# Altium schematic sheet IMX8_DISPLAY.SchDoc
size 594 x 420 mm; SheetNumber: 10; SheetTotal: 20
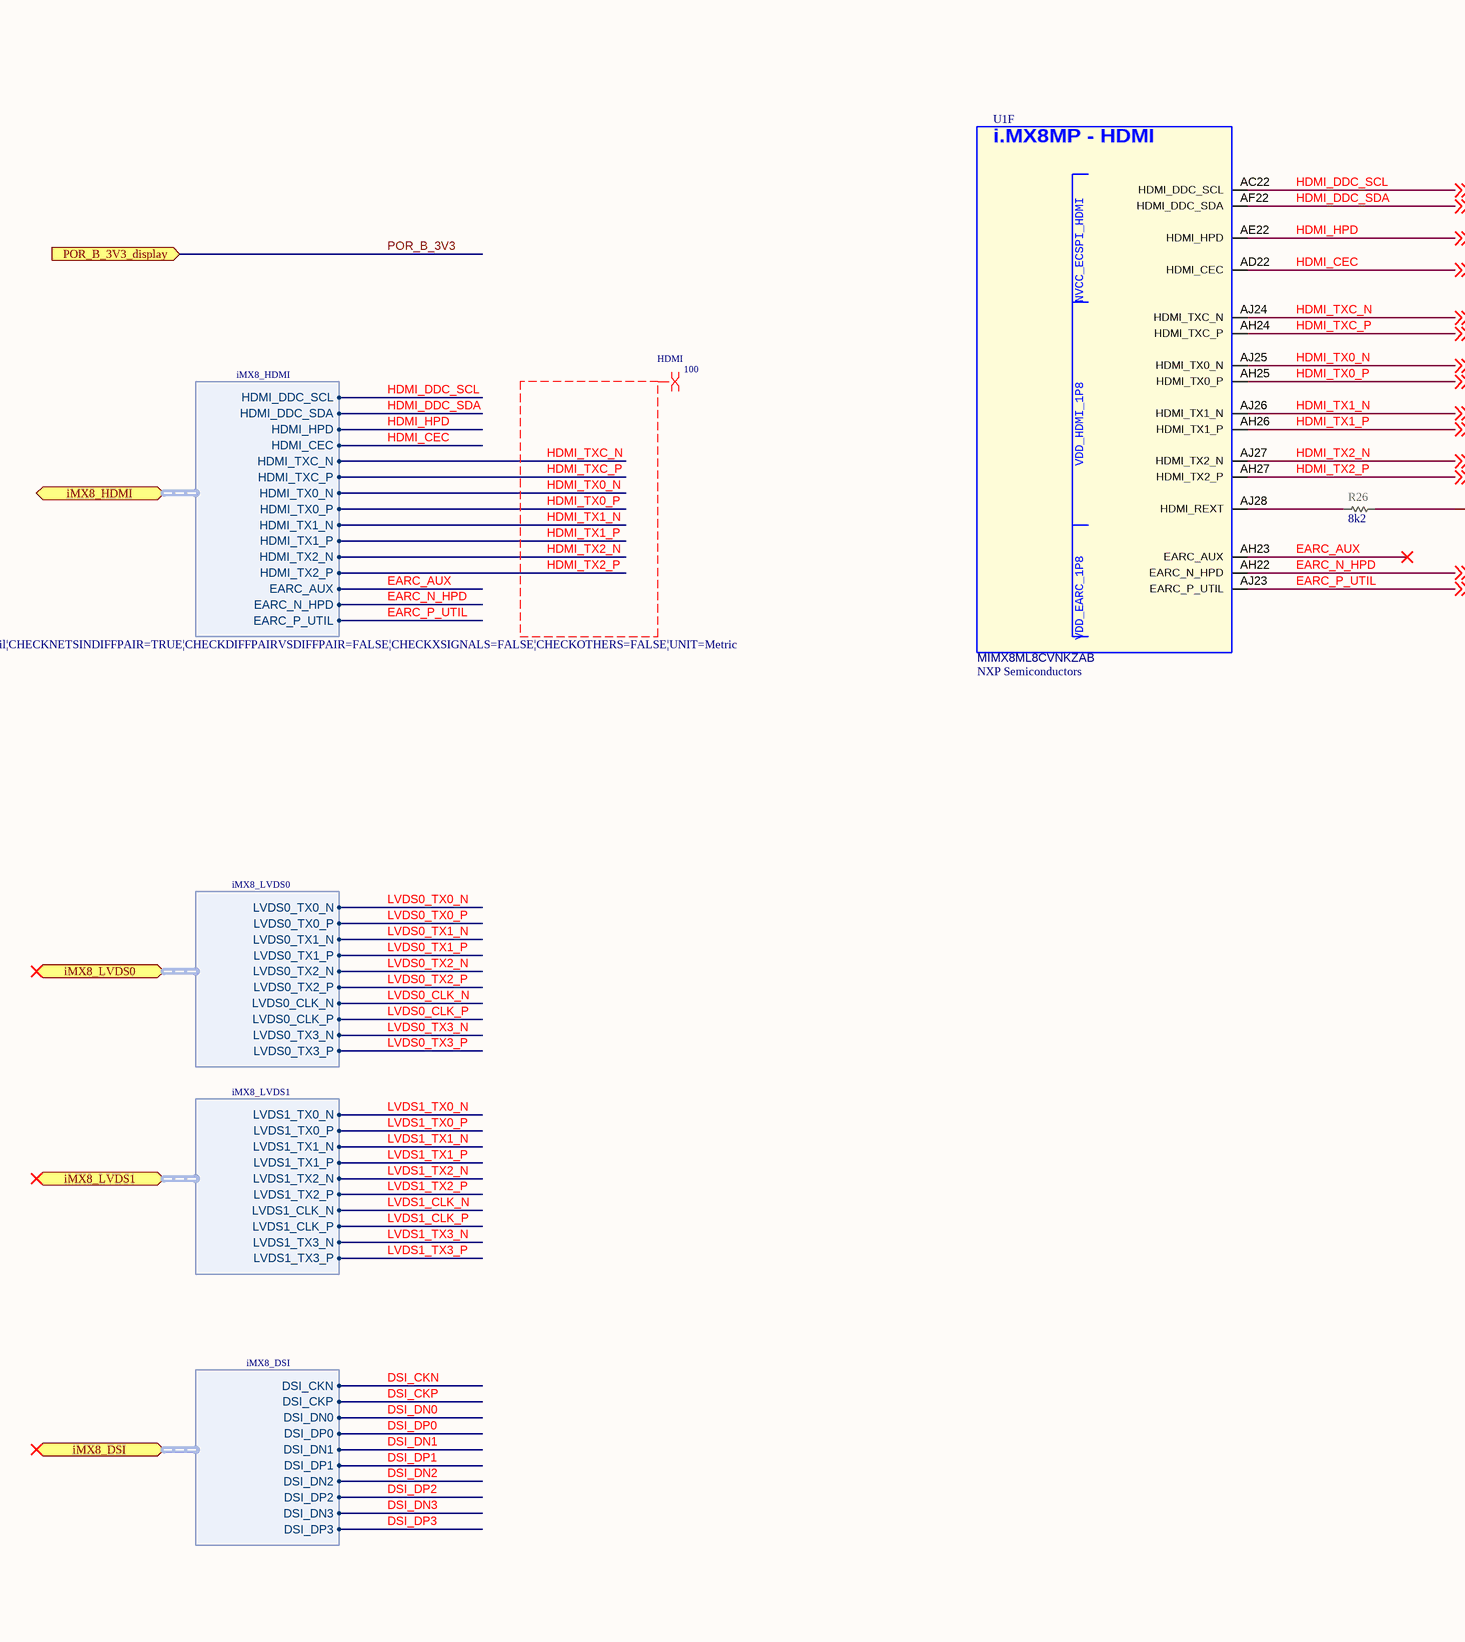
[diagram p0: IMX8_DISPLAY.SchDoc, left]
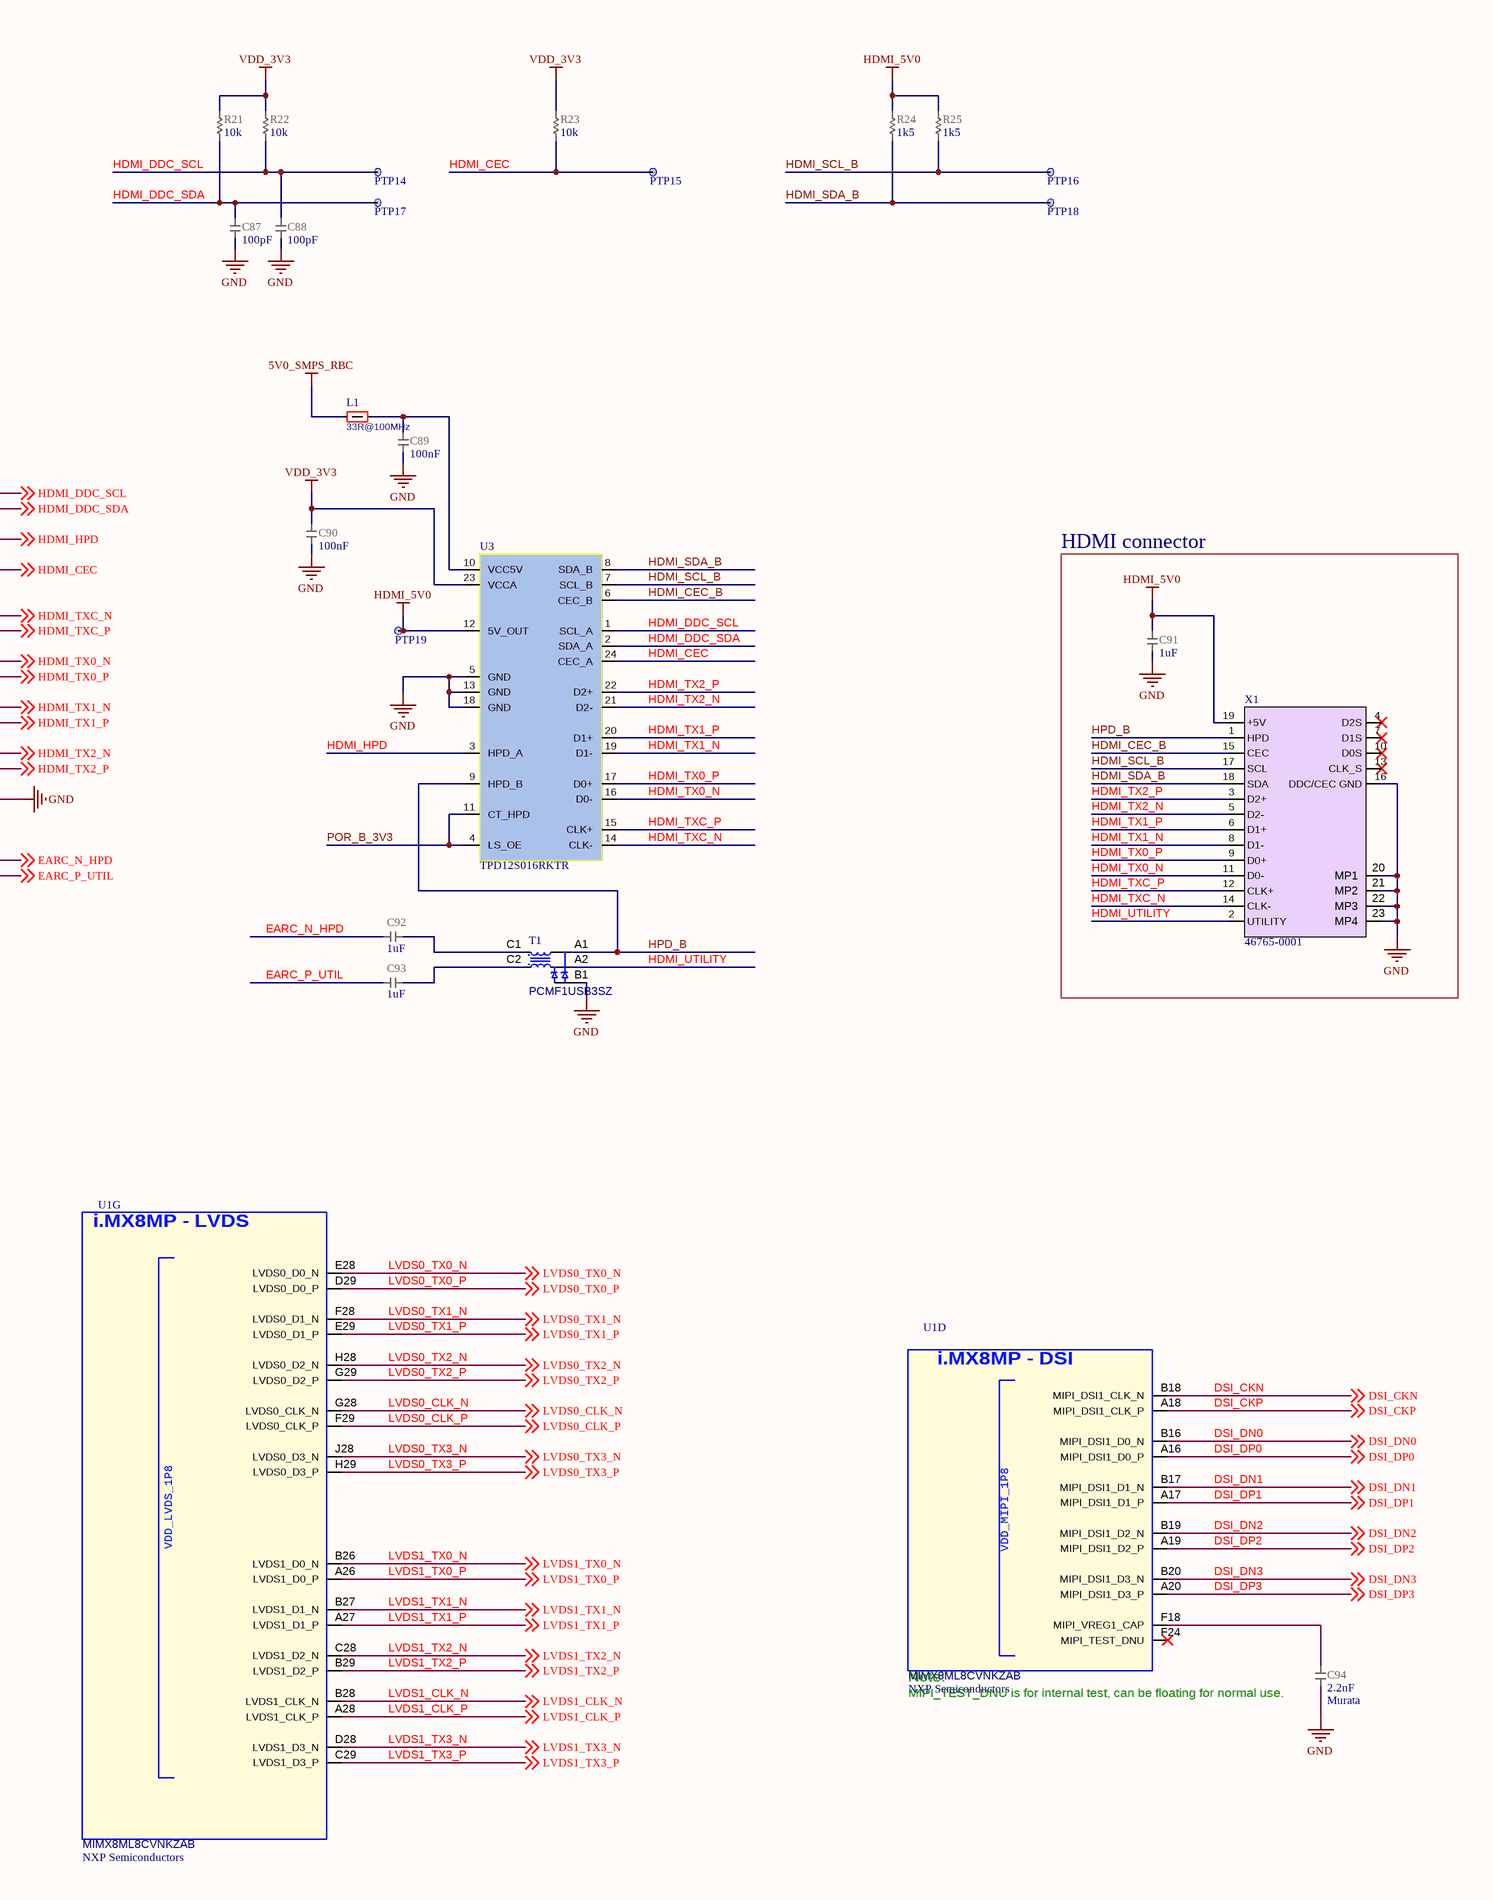
[diagram p1: IMX8_DISPLAY.SchDoc, right]

## Parts
C87  value 100pF  [CAP_0201_UN1Q]  (hidden comment: CAP_0201_100p)
C88  value 100pF  [CAP_0201_UN1Q]  (hidden comment: CAP_0201_100p)
C89  value 100nF  [CAP_0201_UN1Q]  (hidden comment: CAP_0201_100n_X7S_16V)
C90  value 100nF  [CAP_0201_UN1Q]  (hidden comment: CAP_0201_100n_X7S_16V)
C91  value 1uF  [CAP_0201_UN1Q]  (hidden comment: CAP_0201_1uF_X6S)
C92  value 1uF  [CAP_0201_UN1Q]  (hidden comment: CAP_0201_1uF_X6S)
C93  value 1uF  [CAP_0201_UN1Q]  (hidden comment: CAP_0201_1uF_X6S)
C94  value 2.2nF  Manufacturer: Murata  [CAP_0201_UN1Q]  (hidden comment: CAP_0201_2n2)
L1  value 33R@100MHz  [IND_0201_UN1Q]  (hidden comment: FERRITE_0201_BLM03_33Ohm)
PTP14  PTP_0.4mm  [PTP_0.4mm]  (value not drawn)  (no BOM)
PTP15  PTP_0.4mm  [PTP_0.4mm]  (value not drawn)  (no BOM)
PTP16  PTP_0.4mm  [PTP_0.4mm]  (value not drawn)  (no BOM)
PTP17  PTP_0.4mm  [PTP_0.4mm]  (value not drawn)  (no BOM)
PTP18  PTP_0.4mm  [PTP_0.4mm]  (value not drawn)  (no BOM)
PTP19  PTP_0.4mm  [PTP_0.4mm]  (value not drawn)  (no BOM)
R21  value 10k  [RES_0201_UN1Q]  (hidden comment: RES_0201_10k)
R22  value 10k  [RES_0201_UN1Q]  (hidden comment: RES_0201_10k)
R23  value 10k  [RES_0201_UN1Q]  (hidden comment: RES_0201_10k)
R24  value 1k5  [RES_0201_UN1Q]  (hidden comment: RES_0201_1k5)
R25  value 1k5  [RES_0201_UN1Q]  (hidden comment: RES_0201_1k5)
R26  value 8k2  [RES_0201_UN1Q]  (hidden comment: RES_0201_8k2)
T1  Part Number: PCMF1USB3SZ  [PCMF1USB3S_EMI]  (hidden comment: EMI_ESD_PCMF1USB3SZ)
U1  Manufacturer: NXP Semiconductors  [BGA548C50P29X29_1500X1500X148]  (hidden comment: MIMX8ML8CVNKZAB)  (parts D,F,G of 15)
U3  Part Number: TPD12S016RKTR  [UQFN24_RKT0024A_TI]  (hidden comment: TPD12S016RKT)
X1  Part Number: 46765-0001  [uHDMI-SMD-Molex]  (hidden comment: Molex_uHDMI_46765-0001)

## Blocks framed on the sheet
HDMI connector: C91 X1

## Ports
iMX8_DSI (bidir, harness iMX8_DSI), iMX8_HDMI (bidir, harness iMX8_HDMI), iMX8_LVDS0 (bidir, harness iMX8_LVDS0), iMX8_LVDS1 (bidir, harness iMX8_LVDS1), POR_B_3V3_display (in)

## Harnesses
iMX8_LVDS0: LVDS0_TX0_N, LVDS0_TX0_P, LVDS0_TX1_N, LVDS0_TX1_P, LVDS0_TX2_N, LVDS0_TX2_P, LVDS0_CLK_N, LVDS0_CLK_P, LVDS0_TX3_N, LVDS0_TX3_P
iMX8_LVDS1: LVDS1_TX0_N, LVDS1_TX0_P, LVDS1_TX1_N, LVDS1_TX1_P, LVDS1_TX2_N, LVDS1_TX2_P, LVDS1_CLK_N, LVDS1_CLK_P, LVDS1_TX3_N, LVDS1_TX3_P
iMX8_DSI: DSI_CKN, DSI_CKP, DSI_DN0, DSI_DP0, DSI_DN1, DSI_DP1, DSI_DN2, DSI_DP2, DSI_DN3, DSI_DP3
iMX8_HDMI: HDMI_DDC_SCL, HDMI_DDC_SDA, HDMI_HPD, HDMI_CEC, EARC_AUX, EARC_N_HPD, EARC_P_UTIL, HDMI_TXC_N, HDMI_TXC_P, HDMI_TX0_N, HDMI_TX0_P, HDMI_TX1_N, HDMI_TX1_P, HDMI_TX2_N, HDMI_TX2_P

## Nets
5V0_SMPS_RBC: L1.1
GND: C87.1 C88.1 C89.2 C90.2 C91.1 C94.1 R26.2 T1.B1 U3.5(GND) U3.13(GND) U3.18(GND) X1.16(DDC/CEC_GND) X1.20(MP1) X1.21(MP2) X1.22(MP3) X1.23(MP4)
HDMI_5V0: C91.2 PTP19.1(TP) R24.2 R25.2 U3.12(5V_OUT) X1.19(+5V)
VDD_3V3: C90.1 R21.2 R22.2 R23.2 U3.23(VCCA)
DSI_CKN: U1.B18(MIPI_DSI1_CLK_N) ; off-sheet DSI_CKN, port iMX8_DSI.DSI_CKN
DSI_CKP: U1.A18(MIPI_DSI1_CLK_P) ; off-sheet DSI_CKP, port iMX8_DSI.DSI_CKP
DSI_DN0: U1.B16(MIPI_DSI1_D0_N) ; off-sheet DSI_DN0, port iMX8_DSI.DSI_DN0
DSI_DN1: U1.B17(MIPI_DSI1_D1_N) ; off-sheet DSI_DN1, port iMX8_DSI.DSI_DN1
DSI_DN2: U1.B19(MIPI_DSI1_D2_N) ; off-sheet DSI_DN2, port iMX8_DSI.DSI_DN2
DSI_DN3: U1.B20(MIPI_DSI1_D3_N) ; off-sheet DSI_DN3, port iMX8_DSI.DSI_DN3
DSI_DP0: U1.A16(MIPI_DSI1_D0_P) ; off-sheet DSI_DP0, port iMX8_DSI.DSI_DP0
DSI_DP1: U1.A17(MIPI_DSI1_D1_P) ; off-sheet DSI_DP1, port iMX8_DSI.DSI_DP1
DSI_DP2: U1.A19(MIPI_DSI1_D2_P) ; off-sheet DSI_DP2, port iMX8_DSI.DSI_DP2
DSI_DP3: U1.A20(MIPI_DSI1_D3_P) ; off-sheet DSI_DP3, port iMX8_DSI.DSI_DP3
EARC_AUX: U1.AH23(EARC_AUX) ; port iMX8_HDMI.EARC_AUX
EARC_N_HPD: C92.1 U1.AH22(EARC_N_HPD) ; off-sheet EARC_N_HPD, port iMX8_HDMI.EARC_N_HPD
EARC_P_UTIL: C93.1 U1.AJ23(EARC_P_UTIL) ; off-sheet EARC_P_UTIL, port iMX8_HDMI.EARC_P_UTIL
HDMI_CEC: PTP15.1(TP) R23.1 U1.AD22(HDMI_CEC) U3.24(CEC_A) ; off-sheet HDMI_CEC, port iMX8_HDMI.HDMI_CEC
HDMI_CEC_B: U3.6(CEC_B) X1.15(CEC)
HDMI_DDC_SCL: C88.2 PTP14.1(TP) R22.1 U1.AC22(HDMI_DDC_SCL) U3.1(SCL_A) ; off-sheet HDMI_DDC_SCL, port iMX8_HDMI.HDMI_DDC_SCL
HDMI_DDC_SDA: C87.2 PTP17.1(TP) R21.1 U1.AF22(HDMI_DDC_SDA) U3.2(SDA_A) ; off-sheet HDMI_DDC_SDA, port iMX8_HDMI.HDMI_DDC_SDA
HDMI_HPD: U1.AE22(HDMI_HPD) U3.3(HPD_A) ; off-sheet HDMI_HPD, port iMX8_HDMI.HDMI_HPD
HDMI_SCL_B: PTP16.1(TP) R25.1 U3.7(SCL_B) X1.17(SCL)
HDMI_SDA_B: PTP18.1(TP) R24.1 U3.8(SDA_B) X1.18(SDA)
HDMI_TX0_N: U1.AJ25(HDMI_TX0_N) U3.16(D0-) X1.11(D0-) ; off-sheet HDMI_TX0_N, port iMX8_HDMI.HDMI_TX0_N
HDMI_TX0_P: U1.AH25(HDMI_TX0_P) U3.17(D0+) X1.9(D0+) ; off-sheet HDMI_TX0_P, port iMX8_HDMI.HDMI_TX0_P
HDMI_TX1_N: U1.AJ26(HDMI_TX1_N) U3.19(D1-) X1.8(D1-) ; off-sheet HDMI_TX1_N, port iMX8_HDMI.HDMI_TX1_N
HDMI_TX1_P: U1.AH26(HDMI_TX1_P) U3.20(D1+) X1.6(D1+) ; off-sheet HDMI_TX1_P, port iMX8_HDMI.HDMI_TX1_P
HDMI_TX2_N: U1.AJ27(HDMI_TX2_N) U3.21(D2-) X1.5(D2-) ; off-sheet HDMI_TX2_N, port iMX8_HDMI.HDMI_TX2_N
HDMI_TX2_P: U1.AH27(HDMI_TX2_P) U3.22(D2+) X1.3(D2+) ; off-sheet HDMI_TX2_P, port iMX8_HDMI.HDMI_TX2_P
HDMI_TXC_N: U1.AJ24(HDMI_TXC_N) U3.14(CLK-) X1.14(CLK-) ; off-sheet HDMI_TXC_N, port iMX8_HDMI.HDMI_TXC_N
HDMI_TXC_P: U1.AH24(HDMI_TXC_P) U3.15(CLK+) X1.12(CLK+) ; off-sheet HDMI_TXC_P, port iMX8_HDMI.HDMI_TXC_P
HDMI_UTILITY: T1.A2 X1.2(UTILITY)
HPD_B: T1.A1 U3.9(HPD_B) X1.1(HPD)
LVDS0_CLK_N: U1.G28(LVDS0_CLK_N) ; off-sheet LVDS0_CLK_N, port iMX8_LVDS0.LVDS0_CLK_N
LVDS0_CLK_P: U1.F29(LVDS0_CLK_P) ; off-sheet LVDS0_CLK_P, port iMX8_LVDS0.LVDS0_CLK_P
LVDS0_TX0_N: U1.E28(LVDS0_D0_N) ; off-sheet LVDS0_TX0_N, port iMX8_LVDS0.LVDS0_TX0_N
LVDS0_TX0_P: U1.D29(LVDS0_D0_P) ; off-sheet LVDS0_TX0_P, port iMX8_LVDS0.LVDS0_TX0_P
LVDS0_TX1_N: U1.F28(LVDS0_D1_N) ; off-sheet LVDS0_TX1_N, port iMX8_LVDS0.LVDS0_TX1_N
LVDS0_TX1_P: U1.E29(LVDS0_D1_P) ; off-sheet LVDS0_TX1_P, port iMX8_LVDS0.LVDS0_TX1_P
LVDS0_TX2_N: U1.H28(LVDS0_D2_N) ; off-sheet LVDS0_TX2_N, port iMX8_LVDS0.LVDS0_TX2_N
LVDS0_TX2_P: U1.G29(LVDS0_D2_P) ; off-sheet LVDS0_TX2_P, port iMX8_LVDS0.LVDS0_TX2_P
LVDS0_TX3_N: U1.J28(LVDS0_D3_N) ; off-sheet LVDS0_TX3_N, port iMX8_LVDS0.LVDS0_TX3_N
LVDS0_TX3_P: U1.H29(LVDS0_D3_P) ; off-sheet LVDS0_TX3_P, port iMX8_LVDS0.LVDS0_TX3_P
LVDS1_CLK_N: U1.B28(LVDS1_CLK_N) ; off-sheet LVDS1_CLK_N, port iMX8_LVDS1.LVDS1_CLK_N
LVDS1_CLK_P: U1.A28(LVDS1_CLK_P) ; off-sheet LVDS1_CLK_P, port iMX8_LVDS1.LVDS1_CLK_P
LVDS1_TX0_N: U1.B26(LVDS1_D0_N) ; off-sheet LVDS1_TX0_N, port iMX8_LVDS1.LVDS1_TX0_N
LVDS1_TX0_P: U1.A26(LVDS1_D0_P) ; off-sheet LVDS1_TX0_P, port iMX8_LVDS1.LVDS1_TX0_P
LVDS1_TX1_N: U1.B27(LVDS1_D1_N) ; off-sheet LVDS1_TX1_N, port iMX8_LVDS1.LVDS1_TX1_N
LVDS1_TX1_P: U1.A27(LVDS1_D1_P) ; off-sheet LVDS1_TX1_P, port iMX8_LVDS1.LVDS1_TX1_P
LVDS1_TX2_N: U1.C28(LVDS1_D2_N) ; off-sheet LVDS1_TX2_N, port iMX8_LVDS1.LVDS1_TX2_N
LVDS1_TX2_P: U1.B29(LVDS1_D2_P) ; off-sheet LVDS1_TX2_P, port iMX8_LVDS1.LVDS1_TX2_P
LVDS1_TX3_N: U1.D28(LVDS1_D3_N) ; off-sheet LVDS1_TX3_N, port iMX8_LVDS1.LVDS1_TX3_N
LVDS1_TX3_P: U1.C29(LVDS1_D3_P) ; off-sheet LVDS1_TX3_P, port iMX8_LVDS1.LVDS1_TX3_P
POR_B_3V3: U3.4(LS_OE) U3.11(CT_HPD) ; port POR_B_3V3_display
NetC89_1: C89.1 L1.2 U3.10(VCC5V)
NetC92_2: C92.2 T1.C1
NetC93_2: C93.2 T1.C2
NetC94_2: C94.2 U1.F18(MIPI_VREG1_CAP)
NetR26_1: R26.1 U1.AJ28(HDMI_REXT)

Not connected (* = marked no-connect by the designer): U1 F24(MIPI_TEST_DNU)*; X1 4(D2S)* 7(D1S)* 10(D0S)* 13(CLK_S)*

## Layout directives
differential pair; net class HDMI; rule Matched Net Lengths [Tolerance = 0.1mm]; differential pair class 100: HDMI_TX0_N, HDMI_TX0_P, HDMI_TX1_N, HDMI_TX1_P, HDMI_TX2_N, HDMI_TX2_P, HDMI_TXC_N, HDMI_TXC_P

## Notes on the sheet
- (near C94) MIPI_TEST_DNU is for internal test, can be floating for normal use.
- Note:
- DWG NO:
- REV:
- THIS DOCUMENT AND THE DATA DISCLOSED HEREIN OR
- HEREWITH IS THE PROPERTY OF ALTIUM LIMITED AND MAY
- BE FREELY DISTRIBUTED IN WHOLE. NO RIGHTS ARE
- RESERVED OR EXPRESS OR IMPLIED WARANTEE GIVEN.
- REVISION
- DESCRIPTION
- DATE
- APPROVED
- ENG:
- APPROVALS
- PROJECT
- DSN:
- CHK:
- REFERENCE DOCUMENTS
- PROJECT REVISION:
- TITLE
- DOCUMENT REVISION:
- DESIGN ITEM:
- BOM:
- FAB DWG:
- PCB DWG:
- ASSY DWG:
- SCALE:
- A2
- SIZE
- CAGE CODE
- FILE NAME
- DWG NO.
- SHEET
- OF
- REV
- (in symbol CMP-001-000983-8, part D) i.MX8MP - DSI
- (in symbol CMP-001-000983-8, part F) i.MX8MP - HDMI
- (in symbol CMP-001-000983-8, part G) i.MX8MP - LVDS

## Library data of the parts
C87 C88 = CMP-001-000310-14: CAP; Part Number: CC0201KRX7R8BB101; Manufacturer: YAGEO; Temperature characteristics: X7R; Voltage: 25V; Tolerance: +/-10%; Sort order: 302; HasBeenBuilt: TBD; Alternative component: Allowed; System: RLC; Package: 0201; ClassName: SMALL; ComponentLink1Description: 1_Datasheet; ComponentLink2Description: 2_Product page; ComponentLink3Description: 3_X-information; ComponentLink4Description: 4_X-information; Creation date: 20190101
C89 C90 = CMP-001-000385-16: CAP; Part Number: GRM033C71C104KE14D; Manufacturer: Murata; Temperature characteristics: X7S; Tolerance: +/-10%; Sort order: 302; HasBeenBuilt: TBD; Alternative component: Allowed; Voltage: 16V; System: RLC; Package: 0201; ClassName: SMALL; ComponentLink1Description: 1_Datasheet; ComponentLink2Description: 2_Product page; ComponentLink3Description: 3_X-information; ComponentLink4Description: 4_X-information; Creation date: 20190101; Source: RLC_UN1Q.SchLib; Manufacturer Part Number: GRM033C71C104KE14D; Component Type: Capacitor
C91-C93 = CMP-001-000336-15: CAP; Part Number: KGM03CS61A105MH; Manufacturer: Kyocera; Manufacturer: KYOCERA AVX; Temperature characteristics: X6S; Voltage: 10V; Tolerance: +/-20%; Sort order: 302; HasBeenBuilt: False; Alternative component: Allowed; System: RLC; Package: 0201; Operating temperature range: -55C to +105C; ClassName: SMALL; ComponentLink1Description: 1_Datasheet; ComponentLink2Description: 2_Product page; ComponentLink3Description: 3_X-information; ComponentLink4Description: 4_X-information; Creation date: 20190101; Source: RLC_UN1Q.SchLib; Manufacturer Part Number: KGM03CS61A105MH; Component Type: Capacitor
C94 = CMP-001-000281-14: CAP; Part Number: GRM033R71E222KA12J; Temperature characteristics: X7R; Tolerance: +/-10%; Sort order: 302; HasBeenBuilt: TBD; Alternative component: Allowed; Voltage: 25V; System: RLC; Package: 0201; ComponentLink1Description: 1_Datasheet; ComponentLink2Description: 2_Product page; ComponentLink3Description: 3_X-information; ComponentLink4Description: 4_X-information; Creation date: 20222504; ClassName: SMALL; Source: RLC_UN1Q.SchLib; Manufacturer Part Number: GRM033R71E222KA12J; Component Type: Capacitor
L1 = CMP-001-000744-7: FERRITE; Manufacturer: Murata; Part Number: BLM03PG330SN1; Tolerance: 25%; Sort order: 362; HasBeenBuilt: TBD; System: Discrete; Package: 0201; Operating temperature range: -55 ... +125C; ClassName: SMALL; ComponentLink1Description: 1_Datasheet; ComponentLink1URL: https://www.murata.com/en-us/products/productdetail.aspx?cate=luNoiseSupprFilteChipFerriBead&partno=BLM03PG330SN1%23; ComponentLink2Description: 2_Product page; ComponentLink3Description: 3_X-information; ComponentLink4Description: 4_X-information; Creation date: 20200304; Source: Discrete_UN1Q.SchLib; Manufacturer Part Number: BLM03PG330SN1; Component Type: Ferrite
PTP14-PTP19 = CMP-001-001296-3: Production Testpoint 0.4mm. Flying probe. Use 1mm pitch.; Part Number: PTP 0.4mm; ComponentLink4Description: 4_X-information; ComponentLink1Description: 1_Datasheet; Sort order: -; ClassName: SMALL; System: Test Point; HasBeenBuilt: -; Design Item ID: PTP_0.4mm; ComponentLink3Description: 3_X-information; Creation date: 20240909; ComponentLink2Description: 2_Product page; Component Type: Test Point
R21-R23 = CMP-001-000446-13: RES; Part Number: RC0201FR-0710KL; Manufacturer: YAGEO; Power Rating: 1/20W; Sort order: 322; HasBeenBuilt: TBD; Tolerance: 1%; Alternative component: Allowed; System: RLC; Package: 0201; ClassName: SMALL; ComponentLink1Description: 1_Datasheet; ComponentLink2Description: 2_Product page; ComponentLink3Description: 3_X-information; ComponentLink4Description: 4_X-information; Creation date: 20190101; Source: RLC_UN1Q.SchLib; Component Type: Resistor
R24 R25 = CMP-001-000455-11: RES; Part Number: RC0201FR-071K5L; Manufacturer: YAGEO; Power Rating: 1/20W; Sort order: 322; HasBeenBuilt: False; Tolerance: 1%; Alternative component: Allowed; System: RLC; Package: 0201; ClassName: SMALL; ComponentLink1Description: 1_Datasheet; ComponentLink2Description: 2_Product page; ComponentLink3Description: 3_X-information; ComponentLink4Description: 4_X-information; Creation date: 20190101; Source: RLC_UN1Q.SchLib; Component Type: Resistor
R26 = CMP-001-001255-9: RES; Part Number: ERJ1GNF8201C; Manufacturer: Panasonic Electronic Components; Tolerance: 1%; Power Rating: 1/20W; Sort order: 322; Alternative component: Allowed; System: RLC; Package: 0201; ClassName: SMALL; ComponentLink1Description: 1_Datasheet; ComponentLink2Description: 2_Product page; ComponentLink3Description: 3_X-information; ComponentLink4Description: 4_X-information; Creation date: 20240404; Component Type: Resistor
T1 = CMP-001-000967-4: EMI Filter with ESD 15kV differential pair; Manufacturer: Nexperia; Sort order: 441; System: Discrete; ComponentLink1Description: 1_Datasheet; ComponentLink1URL: https://assets.nexperia.com/documents/data-sheet/PCMFXUSB3S_SER.pdf; ComponentLink2Description: 2_Product page; ComponentLink2URL: https://www.nexperia.com/search?searchCategory=&q=PCMF1USB3SZ; ComponentLink3Description: 3_X-information; ComponentLink4Description: 4_X-information; Creation date: 15042024; Dimensions WxLxH: 1.17 x 0.77 x 0.60mm; Operating temperature range: -40 ... +125 °C; Package: WLCSP5; Source: UUDET_KOMPONENTIT.SchLib; Manufacturer Part Number: PCMF1USB3SZ; Component Type: ESD & EMI
U1 = CMP-001-000983-8: CPU QUAD CORTEX A53+M4 1.6GHZ BGA548 Industrial; Sort order: 501; System: IC; ComponentLink1Description: 1_Datasheet; ComponentLink1URL: https://www.nxp.com/part/MIMX8ML8CVNKZAB#/; ComponentLink2Description: 2_Product page; ComponentLink3Description: 3_X-information; ComponentLink4Description: 4_X-information; Creation date: 20240524; Dimensions WxLxH: 15 x 15 x 1.33mm; Manufacturer: NXP SEMICONDUCTORS; Operating temperature range: -40... +105 °C; Package: FCBGA548; Part Number: MIMX8ML8CVNKZAB; ClassName: BIG; Source: UUDET_KOMPONENTIT.SchLib; Design Item ID: MIMX8ML8CVNKZAB; Manufacturer Part Number: MIMX8ML8CVNKZAB; Component Type: Processor
U3 = CMP-031-000038-2: HDMI ESD Protection and I2C Level Shifting Buffer; Manufacturer: Texas Instruments; System: IC; HasBeenBuilt: Saluki3_HW_RIB_2; Sort order: 405; ComponentLink1Description: 1_Datasheet; Dimensions WxLxH: 2.1x4.1x0.55; Source: UUDET_KOMPONENTIT.SchLib; Design Item ID: TPD12S016RKT; ComponentLink1URL: https://www.ti.com/lit/ds/symlink/tpd12s016.pdf; Package: UQFN24; ComponentLink4Description: 4_X-information; ComponentLink3Description: 3_X-information; ComponentLink2URL: https://www.ti.com/product/TPD12S016; ComponentLink2Description: 2_Product page; RoHS: RoHS3; Operating temperature range: -40... +85 °C; Creation Date: 20230510; ECCN: EAR99; Manufacturer Part Number: TPD12S016RKTR; Component Type: ESD & EMI
X1 = CMP-001-000218-15: Micro-HDMI connector, surface mount; Manufacturer: Molex; Sort order: 111; RoHS: RoHS 3; Design Item ID: Molex_uHDMI_46765-0001; ComponentLink1Description: 1_Datasheet; Source: Conn_UN1Q.SchLib; Dimensions WxLxH: 6.5x7.7x2.9; System: Connector; ClassName: BIG; ComponentLink3Description: 3_X-information; ECCN: EAR99; ComponentLink1URL: https://www.molex.com/molex/products/part-detail/io_connectors/0467650001; ComponentLink4Description: 4_X-information; Creation date: 20191231; ComponentLink2Description: 2_Product page; Manufacturer Part Number: 46765-0001; Component Type: Interface Connector